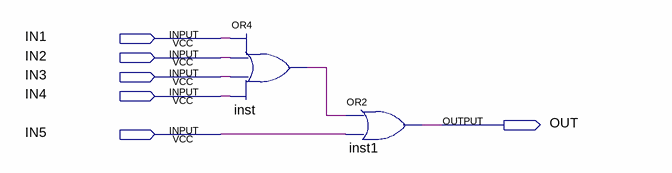
[diagram p0: schematic sheet]
// Quartus schematic or_5b.bdf as structural Verilog: 2 symbols, 6 pins
module or_5b (
  input  IN1,
  input  IN2,
  input  IN3,
  input  IN4,
  input  IN5,
  output OUT
);

  wire inst_out;

  or inst (inst_out, IN1, IN2, IN3, IN4);
  or inst1 (OUT, inst_out, IN5);
endmodule
